# Altium schematic sheet I2C_switch.SchDoc: =DocumentName
size A4; SPICEModelCacheVGBTAUBO: <root> / <DocumentId>VGBTAUBO</DocumentId> / </root>; DocumentNumber: 1; Revision: 0; SheetNumber: 10; SheetTotal: 15; Last modified by: Maciej Przybysz
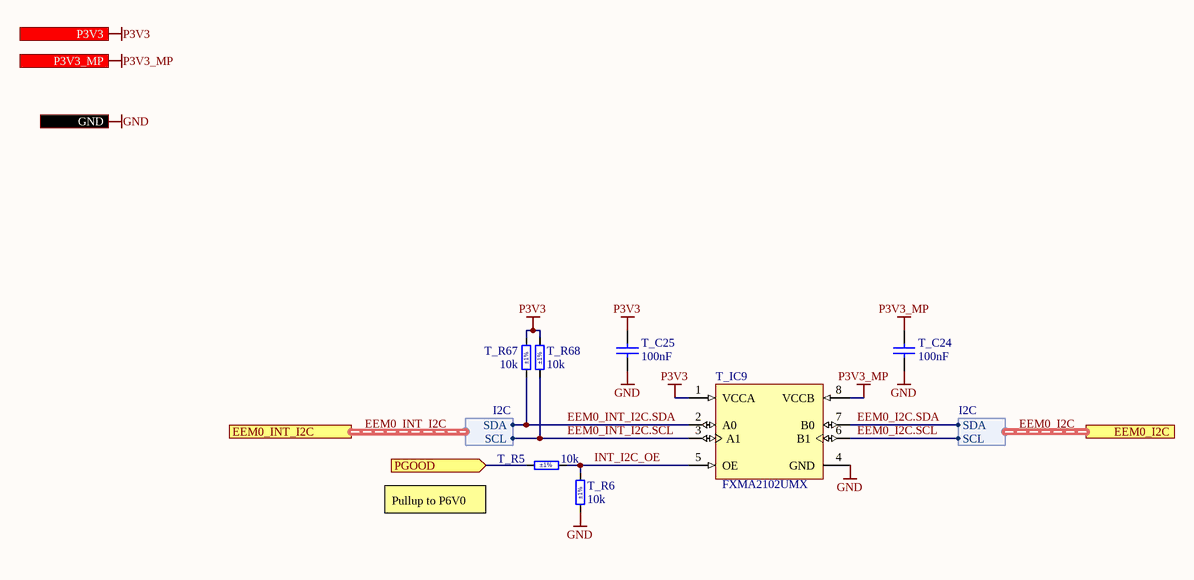
[diagram p0: I2C_switch.SchDoc]

## Parts
T_C24  100nF  [CAPC1005X55N]
T_C25  100nF  [CAPC1005X55N]
T_IC9  FXMA2102UMX  [FXMA2102UMX]
T_R5  10k  Tolerance: ±1%  [RESC1005X40N]
T_R6  10k  Tolerance: ±1%  [RESC1005X40N]
T_R67  10k  Tolerance: ±1%  [RESC1005X40N]
T_R68  10k  Tolerance: ±1%  [RESC1005X40N]

## Ports
EEM0_I2C (harness I2C), EEM0_INT_I2C (harness I2C), GND, P3V3 (in), P3V3_MP (in), PGOOD (in)

## Harnesses
I2C: SDA, SCL

## Nets
GND: T_C24.1 T_C25.1 T_IC9.4(GND) T_R6.1 ; port GND
P3V3: T_C25.2 T_IC9.1(VCCA) T_R67.2 T_R68.2 ; port P3V3
P3V3_MP: T_C24.2 T_IC9.8(VCCB) ; port P3V3_MP
EEM0_I2C.SCL: T_IC9.6(B1) ; port EEM0_I2C.SCL
EEM0_I2C.SDA: T_IC9.7(B0) ; port EEM0_I2C.SDA
EEM0_INT_I2C.SCL: T_IC9.3(A1) T_R68.1 ; port EEM0_INT_I2C.SCL
EEM0_INT_I2C.SDA: T_IC9.2(A0) T_R67.1 ; port EEM0_INT_I2C.SDA
INT_I2C_OE: T_IC9.5(OE) T_R5.2 T_R6.2
PGOOD: T_R5.1 ; port PGOOD

## Buses and harness runs
harness EEM0_I2C = port EEM0_I2C
harness EEM0_INT_I2C = port EEM0_INT_I2C

## Notes on the sheet
- (near T_R5) Pullup to P6V0
- SINARA
- Project:
- Designed by:
- Filename:
- Size:
- Version:
- Last mod. date :
- Sheet:
- A4
- Copyright _______________
  This source describes Open Hardware and is licensed under the CERN-OHL-W v2. You may redistribute and modify this documentation and make products using it under the terms of the CERN-OHL-W v2 (https:/cern.ch/cern-ohl). This documentation is distributed WITHOUT ANY EXPRESS OR IMPLIED WARRANTY, INCLUDING OF MERCHANTABILITY, SATISFACTORY QUALITY AND FITNESS FOR A PARTICULAR PURPOSE. Please see the CERN-OHL-W v2 for applicable conditions.
  As per CERN-OHL-W v2 section 4.1, should You produce hardware based on these sources, You must maintain the Source Location visible on the external case of the product you make using this documentation.
  Source location: =Github
- Last mod. by :

## Library data of the parts
T_C24 T_C25 = CC0402_100NF_50V_10%_X7R: Non-polarised capacitor; Part Description: SMD Multilayer Chip Ceramic Capacitor; Manufacturer: GENERIC; Manufacturer1 Part Number: GRM155R71H104KE14D; Voltage: 50V; TC: X7R; Tolerance: ±10%; Part Number: CC0402_100NF_50V_10%_X7R; Component Kind: Standard; Component Type: Standard; Pin Count: 2; Value: 100nF; Status: None; Manufacturer Part Number: CC0402_100NF_50V_10%_X7R; Case: 0402; Mounted: Yes; Socket: No; SMD: Yes; Sense: No; Manufacturer1 Example: MURATA; Manufacturer1 ComponentHeight: 0.55mm; HelpURL: \\cern.ch\dfs\Applications\Altium\Datasheets\CC0402_MURATA_GRM155R71H104KE14D.pdf; Author: CERN DEM MR; CreateDate: 30.06.2017; LatestRevisionDate: 30.06.2017
T_IC9 = CMP-015-00014-1: Dual Supply 2-Bit Voltage Translator/Buffer/Repeater Isolator for I2C Applications; Manufacturer: Onsemi; Max Supply Voltage: 5.5V; Min Supply Voltage: 1.65V; Min Operating Temperature: -40°C; Pins: 8; Max Operating Temperature: 85°C; Manufacaturer Part Number: FXMA2102UMX; Mounting Technology: Surface Mount
T_R5 T_R6 T_R67 T_R68 = R0402_10K_1%_0.0625W_100PPM: Resistor - 1%; Part Description: General Purpose Thick Film Chip Resistor; Manufacturer: GENERIC; Manufacturer1 Part Number: 232270671003L; TC: ±100ppm/°C; PressFit: No; Part Number: R0402_10K_1%_0.0625W_100PPM; Component Kind: Standard; Component Type: Standard; Pin Count: 2; Value: 10k; Status: Not Recommended; Power: 0.0625W; Manufacturer Part Number: R0402_10K_1%_0.0625W_100PPM; Case: 0402; Mounted: Yes; Sense: No; Socket: No; SMD: Yes; Manufacturer1 Example: YAGEO PHYCOMP; Manufacturer1 ComponentHeight: 0.4mm; HelpURL: \\cern.ch\dfs\Applications\Altium\Datasheets\R0402_Phycomp_RC0402.pdf; Author: CERN DEM JLC; CreateDate: 03.12.2007; LatestRevisionDate: 17.10.2012